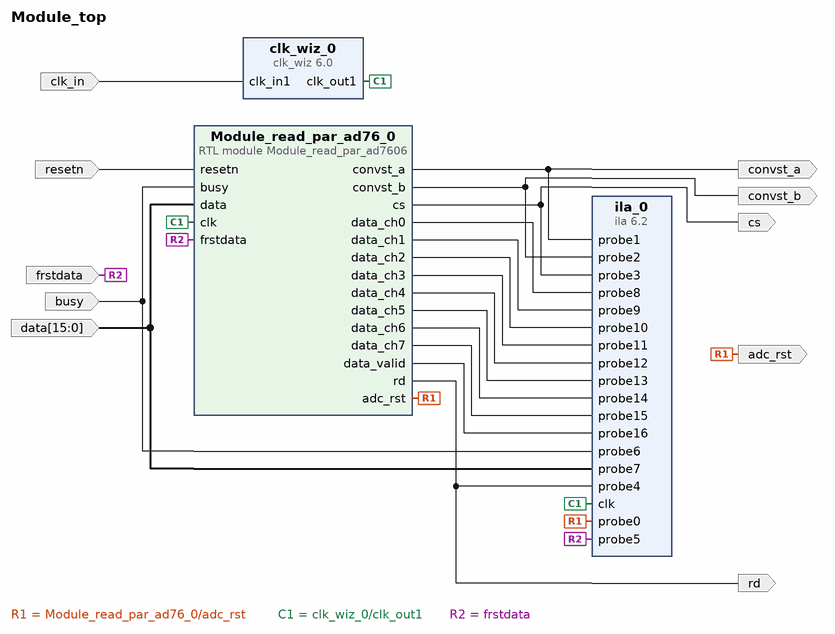
[diagram p0: block diagram of the top level]
# Vivado block design Module_top, xc7a15tcsg325-2, Vivado 2024.1
create_bd_design Module_top

create_bd_port -dir I -type clk clk_in
set_property -dict {CONFIG.FREQ_HZ 50000000} [get_bd_ports clk_in]
create_bd_port -dir I -type rst resetn
create_bd_port -dir I frstdata
create_bd_port -dir I busy
create_bd_port -dir I -from 15 -to 0 data
create_bd_port -dir O -type rst adc_rst
create_bd_port -dir O convst_a
create_bd_port -dir O convst_b
create_bd_port -dir O cs
create_bd_port -dir O rd

create_bd_cell -type module -reference Module_read_par_ad7606 Module_read_par_ad76_0
create_bd_cell -type ip -vlnv xilinx.com:ip:clk_wiz:6.0 clk_wiz_0
set_property -dict [list \
  CONFIG.CLKIN1_JITTER_PS 200.0 \
  CONFIG.CLKOUT1_JITTER 162.035 \
  CONFIG.CLKOUT1_PHASE_ERROR 164.985 \
  CONFIG.MMCM_CLKFBOUT_MULT_F 20.000 \
  CONFIG.MMCM_CLKIN1_PERIOD 20.000 \
  CONFIG.MMCM_CLKIN2_PERIOD 10.0 \
  CONFIG.PRIM_IN_FREQ 50.000 \
  CONFIG.USE_LOCKED false \
  CONFIG.USE_RESET false \
] [get_bd_cells clk_wiz_0]
create_bd_cell -type ip -vlnv xilinx.com:ip:ila:6.2 ila_0
set_property -dict [list \
  CONFIG.C_DATA_DEPTH 2048 \
  CONFIG.C_MONITOR_TYPE Native \
  CONFIG.C_NUM_OF_PROBES 17 \
  CONFIG.C_PROBE10_WIDTH 16 \
  CONFIG.C_PROBE11_WIDTH 16 \
  CONFIG.C_PROBE12_WIDTH 16 \
  CONFIG.C_PROBE13_WIDTH 16 \
  CONFIG.C_PROBE14_WIDTH 16 \
  CONFIG.C_PROBE15_WIDTH 16 \
  CONFIG.C_PROBE7_WIDTH 16 \
  CONFIG.C_PROBE8_WIDTH 16 \
  CONFIG.C_PROBE9_WIDTH 16 \
] [get_bd_cells ila_0]

# ---- connections ----

connect_bd_net [get_bd_pins Module_read_par_ad76_0/adc_rst] [get_bd_ports adc_rst] [get_bd_pins ila_0/probe0]
connect_bd_net [get_bd_pins Module_read_par_ad76_0/convst_a] [get_bd_ports convst_a] [get_bd_pins ila_0/probe1]
connect_bd_net [get_bd_pins Module_read_par_ad76_0/convst_b] [get_bd_ports convst_b] [get_bd_pins ila_0/probe2]
connect_bd_net [get_bd_pins Module_read_par_ad76_0/cs] [get_bd_ports cs] [get_bd_pins ila_0/probe3]
connect_bd_net [get_bd_pins Module_read_par_ad76_0/data_ch0] [get_bd_pins ila_0/probe8]
connect_bd_net [get_bd_pins Module_read_par_ad76_0/data_ch1] [get_bd_pins ila_0/probe9]
connect_bd_net [get_bd_pins Module_read_par_ad76_0/data_ch2] [get_bd_pins ila_0/probe10]
connect_bd_net [get_bd_pins Module_read_par_ad76_0/data_ch3] [get_bd_pins ila_0/probe11]
connect_bd_net [get_bd_pins Module_read_par_ad76_0/data_ch4] [get_bd_pins ila_0/probe12]
connect_bd_net [get_bd_pins Module_read_par_ad76_0/data_ch5] [get_bd_pins ila_0/probe13]
connect_bd_net [get_bd_pins Module_read_par_ad76_0/data_ch6] [get_bd_pins ila_0/probe14]
connect_bd_net [get_bd_pins Module_read_par_ad76_0/data_ch7] [get_bd_pins ila_0/probe15]
connect_bd_net [get_bd_pins Module_read_par_ad76_0/data_valid] [get_bd_pins ila_0/probe16]
connect_bd_net [get_bd_pins Module_read_par_ad76_0/rd] [get_bd_ports rd] [get_bd_pins ila_0/probe4]
connect_bd_net -net busy_0_1 [get_bd_ports busy] [get_bd_pins ila_0/probe6] [get_bd_pins Module_read_par_ad76_0/busy]
connect_bd_net -net clk_in1_0_1 [get_bd_ports clk_in] [get_bd_pins clk_wiz_0/clk_in1]
connect_bd_net [get_bd_pins clk_wiz_0/clk_out1] [get_bd_pins ila_0/clk] [get_bd_pins Module_read_par_ad76_0/clk]
connect_bd_net -net data_0_1 [get_bd_ports data] [get_bd_pins ila_0/probe7] [get_bd_pins Module_read_par_ad76_0/data]
connect_bd_net -net frstdata_0_1 [get_bd_ports frstdata] [get_bd_pins ila_0/probe5] [get_bd_pins Module_read_par_ad76_0/frstdata]
connect_bd_net -net resetn_0_1 [get_bd_ports resetn] [get_bd_pins Module_read_par_ad76_0/resetn]

validate_bd_design
save_bd_design
